# Altium schematic sheet Input.SchDoc
size A4; SheetNumber: 2; SheetTotal: 4
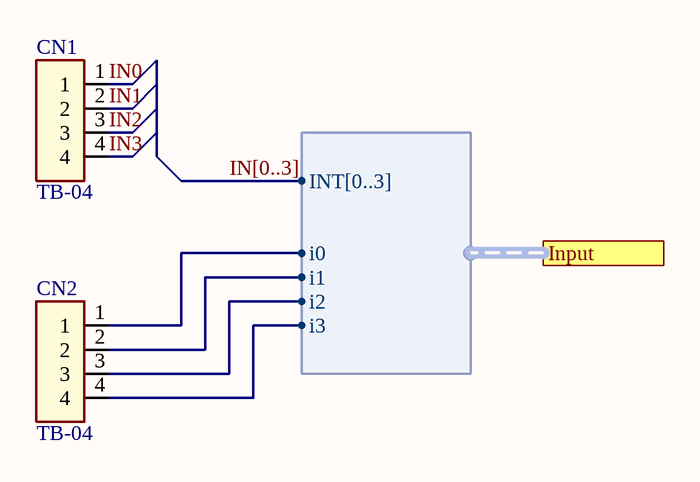
[diagram p0: Input.SchDoc]

## Parts
CN1  TB-04  [TB508-04]
CN2  TB-04  [TB508-04]

## Ports
Input (harness Input)

## Harnesses
Input: INT[0..3], i0, i1, i2, i3

## Nets
IN0: CN1.1
IN1: CN1.2
IN2: CN1.3
IN3: CN1.4
NetCN2_1: CN2.1 ; port Input.i0
NetCN2_2: CN2.2 ; port Input.i1
NetCN2_3: CN2.3 ; port Input.i2
NetCN2_4: CN2.4 ; port Input.i3

## Buses and harness runs
bus IN[0..3]

## Library data of the parts
CN1 CN2 = TB-04: Terminal Block; Manufacturer: *; Part number: *; Unit price: *; Value: TB-04